# Altium schematic sheet norbi_lm_usb.SchDoc: Имя
size 209 x 297 mm; ApprovedBy: Утвердил; CheckedBy: Проверил; Author: Разработал; Organization: НГУ; DocumentNumber: Децимальный номер Э3; SheetNumber: Лист; SheetTotal: Листов; PageSetup: Record=PageOptions|CenterHorizontal=True|CenterVertical=True|PrintScale=1.00|XCorrection=1.00|YCorrection=1.00|PrintKind=1|BorderSize=5000000|LeftOffset=0|BottomOffset=0|Orientation=2|PaperLength=1000|PaperWidth=1000|Scale=100|PaperSource=15|PrintQuality=1200|MediaType=1|DitherType=10|PaperKind=A3|PrintScaleMode=1; Weight: -; ScaleFactor: -; NormInspection: Норм.Контр.
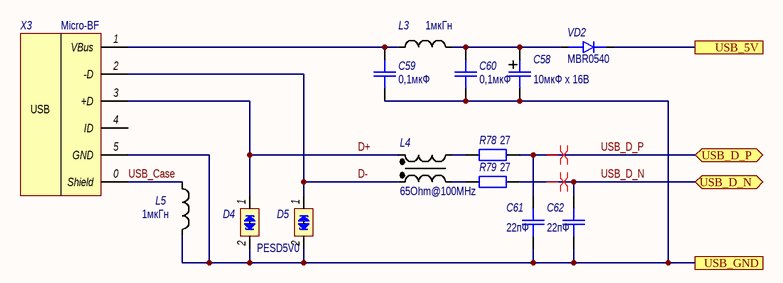
[diagram p0: norbi_lm_usb.SchDoc]

## Parts
C58  10мкФ х 16В  [C_SMD_SIZE_B]
C59  0,1мкФ  [CR-0603]
C60  0,1мкФ  [CR-0603]
C61  22пФ  [CR-0603]
C62  22пФ  [CR-0603]
D4  PESD5V0  [SOD-323]
D5  PESD5V0  [SOD-323]  (value not drawn)
L3  1мкГн  [CR-0805]
L4  65Ohm@100MHz  [ACM2012]
L5  1мкГн  [CR-0805]
R78  27  [CR-0603]
R79  27  [CR-0603]
VD2  MBR0540  [SOD-323]
X3  Наименование: Micro-BF  [USB Micro-BF]  (hidden comment: mico-BF)

## Ports
USB_5V, USB_D_N (bidir), USB_D_P (bidir), USB_GND

## Nets
D+: D4.1(cathode_1) L4.2 X3.3(+D)
D-: D5.1(cathode_1) L4.1 X3.2(-D)
USB_5V: VD2.1(Cathode) ; port USB_5V
USB_Case: L5.1 X3.0(Shield)
USB_D_N: C62.2 R79.1 ; port USB_D_N
USB_D_P: C61.2 R78.1 ; port USB_D_P
USB_GND: C58.2 C59.1 C60.1 C61.1 C62.1 D4.2(cathode_2) D5.2(cathode_2) L5.2 X3.5(GND) ; port USB_GND
NetC58_1: C58.1 C60.2 L3.2 VD2.2(Anode)
NetC59_2: C59.2 L3.1 X3.1(VBus)
NetL4_3: L4.3 R78.2
NetL4_4: L4.4 R79.2

Not connected (* = marked no-connect by the designer): X3 4(ID)

## Layout directives
differential pair: USB_D_N, USB_D_P

## Notes on the sheet
- Подп. и дата
- Инв. № дубл.
- Взам. инв. №
- Инв. № подл.
- Изм.
- Лист
- № докум.
- Подп.
- Дата
- Форма 2а ГОСТ 2.104-2006
- Копировал
- Формат А4
- (in symbol MicroUSB) USB

## Library data of the parts
C58 = C_pol_smd: Поляризованный конеднсатор для поверхностного монтажа; Назначение: Поляризованный чип-конденсатор; Наименование: Конденсатор танталовый SMD; Потребление, Вт: 0; Value: 10мкФ х 16В
C59-C62 = C_smd: Конденсатор для поверхностного монтажа; Назначение: Чип-конденсатор; Потребление, Вт: 0; Наименование: SMD-0603
  C59 C60: Value: 0,1мкФ
  C61 C62: Value: 22пФ
D4 D5 = PESD5V0S: Low capacitance bidirectional ESD protection diodes; Назначение: ESD защитные диоды; Потребление, Вт: 0,000; Наименование: PESD5V0S1BA
L3 L5 = L_smd: Индуктивность для поверхностнгого монтажа; Назначение: Чип-индуктивность; Потребление, Вт: 0,010; Value: 1мкГн; Наименование: Индуктивность
L4 = ACM2012_USB_CM_FILTER: USB common mode filter; Назначение: Связанная индуктивность; Наименование: ACM2012-900-2P; Потребление, Вт: 0,001; Value: 65Ohm@100MHz
R78 R79 = R_smd: Резистор для поверхностного монтажа; Наименование: SMD-0603 20%; Назначение: Чип-резистор; Потребление, Вт: 0,001; Value: 27
VD2 = BAT60A: Schottky diode; Назначение: Диод шотки; Потребление, Вт: 0,001; Наименование: MBR0540
X3 = MicroUSB: USB mico-BF; Назначение: Micro-USB разъем на плату